# Altium schematic sheet SCH_Clock_Led.SchDoc
size A4; SheetNumber: 1; SheetTotal: 1
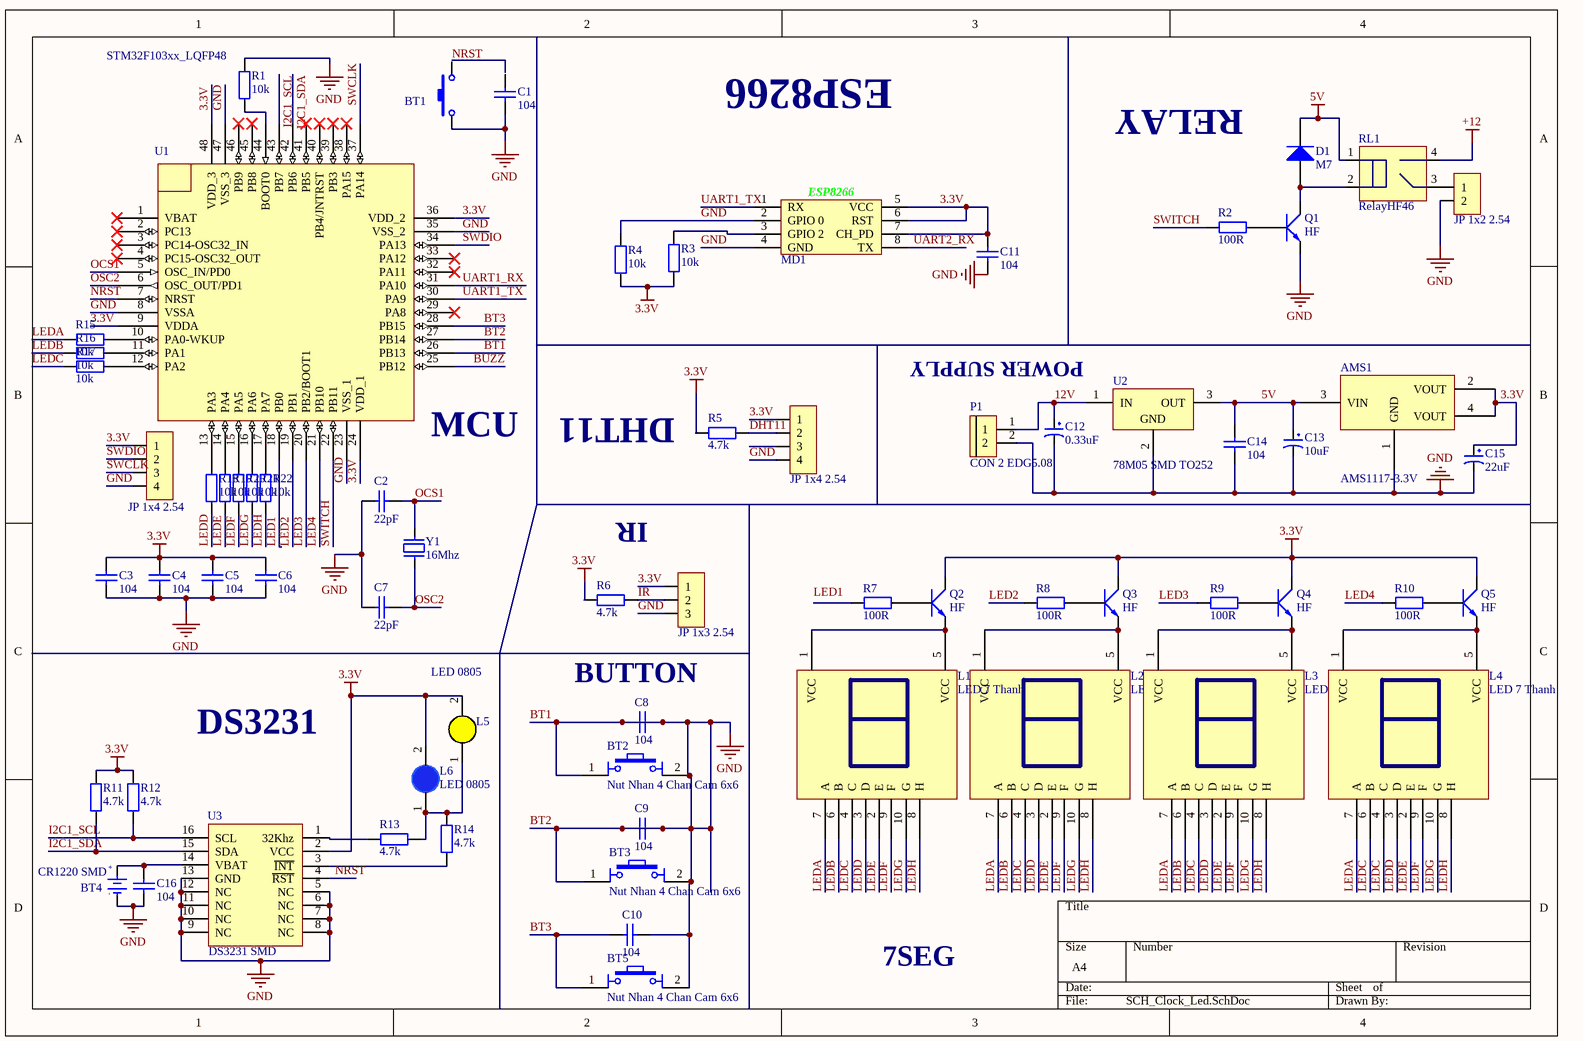
[diagram p0: SCH_Clock_Led.SchDoc]

## Parts
AMS1  AMS1117-3.3V  [SOT223]
BT1  Nut Nhan 2 Chan SMD 3x6x2.5  [Nut Nhan 2 Chan SMD 3x6x2.5]  (value not drawn)
BT2  Nut Nhan 4 Chan Cam 6x6  [Nut Nhan 4 Chan Cam 6x6]
BT3  Nut Nhan 4 Chan Cam 6x6  [Nut Nhan 4 Chan Cam 6x6]
BT4  CR1220 SMD  [DE PIN CR1220]
BT5  Nut Nhan 4 Chan Cam 6x6  [Nut Nhan 4 Chan Cam 6x6]
C1  104  [tu 0805]
C2  22pF  [tu 0805]
C3  104  [tu 0805]
C4  104  [tu 0805]
C5  104  [tu 0805]
C6  104  [tu 0805]
C7  22pF  [tu 0805]
C8  104  [tu 0805]
C9  104  [tu 0805]
C10  104  [tu 0805]
C11  104  [tu 0805]
C12  0.33uF  [tu hoa 5mm]
C13  10uF  [tu hoa 13mm]
C14  104  [tu 0805]
C15  22uF  [tu hoa 5mm]
C16  104  [tu 0805]
D1  M7  [DIODE SMA]
JP1  JP 1x4 2.54  [JP 1x4 DT]
JP2  JP 1x4 2.54  [JP 1x4 DT]
JP3  JP 1x3 2.54  [JP 1x3 CT]
JP4  JP 1x2 2.54  [JP 1x2 DT]
L1  LED 7 Thanh
L2  LED 7 Thanh
L3  LED 7 Thanh
L4  LED 7 Thanh
L5  LED 0805  [LED-1206-Yellow]
L6  LED 0805  [LED-0805-Blue]
MD1  ESP8266 Module  [ESP2866 Module]  (value not drawn)
P1  CON 2 EDG5.08  [CON 2 2EDG5.08]
Q1  HF  [SOT23]
Q2  HF  [SOT23]
Q3  HF  [SOT23]
Q4  HF  [SOT23]
Q5  HF  [SOT23]
R1  10k  [tro smd 0805]
R2  100R  [tro smd 0805]
R3  10k  [tro smd 0805]
R4  10k  [tro smd 0805]
R5  4.7k  [tro smd 0805]
R6  4.7k  [tro smd 0805]
R7  100R  [tro smd 0805]
R8  100R  [tro smd 0805]
R9  100R  [tro smd 0805]
R10  100R  [tro smd 0805]
R11  4.7k  [tro smd 0805]
R12  4.7k  [tro smd 0805]
R13  4.7k  [tro smd 0805]
R14  4.7k  [tro smd 0805]
R15  10k  [tro smd 0805]
R16  10k  [tro smd 0805]
R17  10k  [tro smd 0805]
R18  10k  [tro smd 0805]
R19  10k  [tro smd 0805]
R20  10k  [tro smd 0805]
R21  10k  [tro smd 0805]
R22  10k  [tro smd 0805]
RL1  RelayHF46  [Relay 4 chan HF46F]
U1  STM32F103xx_LQFP48  [STM32_LQPF48]
U2  78M05 SMD TO252  [TO252]
U3  DS3231 SMD  [SOIC 16]
Y1  16Mhz  [Thach Anh 2 chan SMD]

## Nets
3.3V: AMS1.2(VOUT) AMS1.4(VOUT) C3.1 C4.1 C5.1 C6.1 C11.2 C15.1 JP1.1 JP2.1 JP3.1 L5.2(K) L6.2(K) MD1.5(VCC) MD1.6(RST) MD1.7(CH_PD) Q2.3(C) Q3.3(C) Q4.3(C) Q5.3(C) R3.2 R4.1 R5.1 R6.1 R11.2 R12.2 U1.9(VDDA) U1.24(VDD_1) U1.36(VDD_2) U1.48(VDD_3) U3.2(VCC)
5V: AMS1.3(VIN) C13.1 C14.1 D1.2(K) RL1.1 U2.3(OUT)
+12: RL1.4(AC/DC)
BT1: AMS1.1(GND) BT1.1 BT2.1 BT2.2 BT3.1 BT3.2 BT4.2(GND) BT5.2 C1.2 C2.1 C3.2 C4.2 C5.2 C6.2 C7.1 C8.1 C8.2 C9.1 C9.2 C10.1 C11.1 C12.2 C13.2 C14.2 C15.2 C16.2 JP1.4 JP2.4 JP3.3 JP4.2 MD1.2(GPIO_0) MD1.4(GND) P1.2 Q1.2(E) R1.2 R4.2 U1.8(VSSA) U1.23(VSS_1) U1.26(PB13) U1.27(PB14) U1.35(VSS_2) U1.47(VSS_3) U2.2(GND) U3.5(NC) U3.6(NC) U3.7(NC) U3.8(NC) U3.9(NC) U3.10(NC) U3.11(NC) U3.12(NC) U3.13(GND)  [also labelled BT2, GND]
12V: C12.1 P1.1 U2.1(IN)
BT3: BT5.1 C10.2 U1.28(PB15)
BUZZ: U1.25(PB12)
DHT11: JP1.2 R5.2
I2C1_SCL: R12.1 U1.43(PB7) U3.16(SCL)
I2C1_SDA: R11.1 U1.42(PB6) U3.15(SDA)
IR: JP3.2 R6.2
LED1: U1.18(PB0)
LED2: R8.1 U1.19(PB1)
LED3: R9.1 U1.20(PB2/BOOT1)
LED4: R10.1 U1.21(PB10)
LEDA: L1.7(A) L2.7(A) L3.7(A) L4.7(A) R15.1
LEDB: L1.6(B) L2.6(B) L3.6(B) R16.1
LEDC: L1.4(C) L2.4(C) L3.4(C) L4.4(C) L4.6(B) R17.1
LEDD: L1.3(D) L2.3(D) L3.3(D) L4.3(D) R18.1
LEDE: L1.2(E) L2.2(E) L3.2(E) L4.2(E) R19.1
LEDF: L1.9(F) L2.9(F) L3.9(F) L4.9(F) R20.1
LEDG: L1.10(G) L2.10(G) L3.10(G) L4.10(G) R21.1
LEDH: L1.8(H) L2.8(H) L3.8(H) L4.8(H) R22.1
NRST: BT1.2 U1.7(NRST) U3.4(~{RST})
OCS1: C2.2 U1.5(OSC_IN/PD0) Y1.2
OSC2: C7.2 U1.6(OSC_OUT/PD1) Y1.1
SWCLK: JP2.3 U1.37(PA14)
SWDIO: JP2.2 U1.34(PA13)
SWITCH: R2.1 U1.22(PB11)
UART1_RX: U1.31(PA10)
UART1_TX: MD1.1(RX) U1.30(PA9)
UART2_RX: MD1.8(TX)
NetBT4_1: BT4.1(+3V) C16.1 U3.14(VBAT)
NetD1_1: D1.1(A) Q1.3(C) RL1.2
NetJP4_1: JP4.1 RL1.3(AC/DC)
NetL1_1: L1.1(VCC) L1.5(VCC) Q2.2(E)
NetL2_1: L2.1(VCC) L2.5(VCC) Q3.2(E)
NetL3_1: L3.1(VCC) L3.5(VCC) Q4.2(E)
NetL4_1: L4.1(VCC) L4.5(VCC) Q5.2(E)
NetL5_1: L5.1(A) L6.1(A) R13.1 R14.1
NetMD1_3: MD1.3(GPIO_2) R3.1
NetQ1_1: Q1.1(B) R2.2
NetQ2_1: Q2.1(B) R7.2
NetQ3_1: Q3.1(B) R8.2
NetQ4_1: Q4.1(B) R9.2
NetQ5_1: Q5.1(B) R10.2
NetR1_1: R1.1 U1.44(BOOT0)
NetR13_2: R13.2 U3.1(32Khz)
NetR14_2: R14.2 U3.3(~{INT})
NetR15_2: R15.2 U1.10(PA0-WKUP)
NetR16_2: R16.2 U1.11(PA1)
NetR17_2: R17.2 U1.12(PA2)
NetR18_2: R18.2 U1.13(PA3)
NetR19_2: R19.2 U1.14(PA4)
NetR20_2: R20.2 U1.15(PA5)
NetR21_2: R21.2 U1.16(PA6)
NetR22_2: R22.2 U1.17(PA7)

Not connected (* = marked no-connect by the designer): C1 1; JP1 3; R7 1; U1 1(VBAT)* 2(PC13)* 3(PC14-OSC32_IN)* 4(PC15-OSC32_OUT)* 29(PA8)* 32(PA11)* 33(PA12)* 38(PA15)* 39(PB3)* 40(PB4/JNTRST)* 41(PB5)* 45(PB8)* 46(PB9)*

## Notes on the sheet
- ESP8266
- RELAY
- POWER SUPPLY
- (near U1) MCU
- (near R5) DHT11
- IR
- BUTTON
- DS3231
- 7SEG
- Labels drawn without touching a wire or pin: LED1
- (in symbol De pin CR1220 SMD) +; -
- (in symbol ESP8266 Module) ESP8266

## Library data of the parts
AMS1 = AMS1117 SMD: Dán; Value: AMS1117-3.3V SOT223; Don_Vi: Con; Ma_Hang: MH000596; Ghi_Chu: *; Kieu_Chan: *; Chung_Loai: Dán
BT1 = Nut Nhan 2 Chan SMD 3x6x2.5: Ma_Hang: MH001036; Ten: Nút Nhấn 2 Chân 3x6x2.5MM SMD
BT2 BT3 BT5 = Nut Nhan 4 Chan Cam 6x6: Nut Nhan 4 Chan 6x6mm; Ten: Nút Nhấn 4 Chân 6x6x5MM DIP; Ma_Hang: MH004584
BT4 = De pin CR1220 SMD: Ten: Đế PIN CR1220 SMD; Ma_Hang: MH000833
C1 C3-C6 C8-C11 C14 C16 = Tu 0805 104 50V 10%: Dán; Don_Vi: Con; So_Chan: 2; Ten_Linh_Kien: Tụ 0805 104-100nF 10% 50V; Ma_Hang: MH004551; Chung_Loai: Dán; Kieu_Chan: *
C2 C7 = Tu 0805 22pF 50V 10%: Dán; Don_Vi: Con; So_Chan: 2; Ten_Linh_Kien: Tụ 0805 22P 10% 50V; Ma_Hang: MH004560; Chung_Loai: Dán; Kieu_Chan: *
C12 = Tu Hoa 0.33uF 50V 5x11: Cắm; Don_Vi: Con; So_Chan: 2; Ten_Linh_Kien: Tụ Hóa 0.33uF 50V 5x11MM; Ma_Hang: MH004655; Chung_Loai: Cắm; Kieu_Chan: *
C13 = Tu Hoa 10uF 450V 13x20: Cắm; Don_Vi: Con; So_Chan: 2; Ten_Linh_Kien: Tụ Hóa 10uF 450V 13x20MM; Ma_Hang: MH003950; Chung_Loai: Cắm; Kieu_Chan: *
C15 = Tu Hoa 22uF 35V 5x11: Cắm; Don_Vi: Con; So_Chan: 2; Ten_Linh_Kien: Tụ Hóa 22uF 35V 5x11MM; Ma_Hang: MH001350; Chung_Loai: Cắm; Kieu_Chan: *
D1 = Diode M7 ( 4007 ): Dán; Don_Vi: Con; Ten_Linh_Kien: Diode M7 1N4007 SMD 1A 1000V; Ma_Hang: MH000944; Chung_Loai: Dán; Ghi_Chu: *
JP1 JP2 = JP 1x4 2.54 Duc Thang: Cắm; Ten_Linh_Kien: Jump Đơn Đực 2.54MM 1x40P Thẳng 11MM; Don_Vi: Con; Ma_Hang: MH000903; Ghi_Chu: *; Kieu_Chan: *; Chung_Loai: Cắm
JP3 = JP 1x3 2.54 Cai Thang: Cắm; Ten_Linh_Kien: Jump Đơn Cái 2.54MM 1x20P Thẳng; Don_Vi: Con; Ma_Hang: MH004006; Ghi_Chu: *; Kieu_Chan: *; Chung_Loai: Cắm
JP4 = JP 1x2 2.54 Duc Thang: Cắm; Ten_Linh_Kien: Jump Đơn Đực 2.54MM 1x40P Thẳng 11MM; Don_Vi: Con; Ma_Hang: MH000903; Ghi_Chu: *; Kieu_Chan: *; Chung_Loai: Cắm
L1-L4 = LED 7x1 2.3inch Anot: Dán; Don_Vi: Con; Ma_Hang: MH000901; Ten_Linh_Kien: Led 7 2.3 1 Số Anot (Sáng Đỏ); Ghi_Chu: *; Kieu_Chan: *; Chung_Loai: Dán
L5 = LED 1206 Vang: Dán; Don_Vi: Con; Ma_Hang: MH002331; Ten_Linh_Kien: LED1206 Màu Vàng (Yellow); Ghi_Chu: *; Kieu_Chan: *; Chung_Loai: Dán
L6 = LED 0805 Xanh Duong: Dán; Don_Vi: Con; Ma_Hang: MH002327; Ten_Linh_Kien: LED 0805 Màu Xanh Dương (Blue); Ghi_Chu: *; Kieu_Chan: *; Chung_Loai: Dán
P1 = CON 2 EDG5.08: Cắm; Ten_Linh_Kien: CON 2 2EDG5.08-2P 5.08MM ( Xanh Cong); Ma_Hang: MH000759; Ghi_Chu: *; Don_Vi: Con; Kieu_Chan: *; Chung_Loai: Cắm
Q1-Q5 = C1815 HF SMD: NPN transistor; Value: C9014
R1 R3 R4 R15-R22 = Tro 0805 5% 10k: Dán; Don_Vi: Con; So_Chan: 2; Ten_Linh_Kien: Trở 0805 5% 10k; Ma_Hang: MH005239; Chung_Loai: Dán; Kieu_Chan: *
R2 R7-R10 = Tro 0805 5% 100R: Dán; Don_Vi: Con; So_Chan: 2; Ten_Linh_Kien: Trở 0805 5% 100R; Ma_Hang: MH005251; Chung_Loai: Dán; Kieu_Chan: *
R5 R6 R11-R14 = Tro 0805 5% 4.7k: Dán; Don_Vi: Con; So_Chan: 2; Ten_Linh_Kien: Trở 0805 5% 4.7k; Ma_Hang: MH005307; Chung_Loai: Dán; Kieu_Chan: *
RL1 = Relay 4 chan HF46F: Ten: Relay 5V5A HF46F-G 5-HS1; Ma_Hang: MH003879
U2 = 78M05 SMD TO252: Dán; Don_Vi: Con; Ten_Linh_Kien: 78M05 TO252; Ma_Hang: MH001917; Ghi_Chu: *; Kieu_Chan: *; Chung_Loai: Dán
U3 = DS3231 SMD: SOIC
Y1 = Thach Anh 2 chan SMD: Crystal For all Crystal 2pin.; Value: 4Mhz
U1 = STM32F103xx_LQFP48: Published: 30-May-2008; DatasheetVersion: rev6, Mar-2008; PackageVersion: Mar-2008; PackageReference: LQFP48; Publisher: Altium Limited; PackageDescription: 48-Pin Low-Profile Quad Flat Pack, 7 x 7 mm Body, 0.5 mm Pitch (LQFP48); ComponentLink1Description: Manufacturer Link; ComponentLink1URL: www.st.com/stm32; ComponentLink2Description: Datasheet; ComponentLink2URL: http://www.st.com/stonline/products/literature/ds/13587.pdf